# EAGLE design USBtoATAPI (EAGLE 9.6.2)
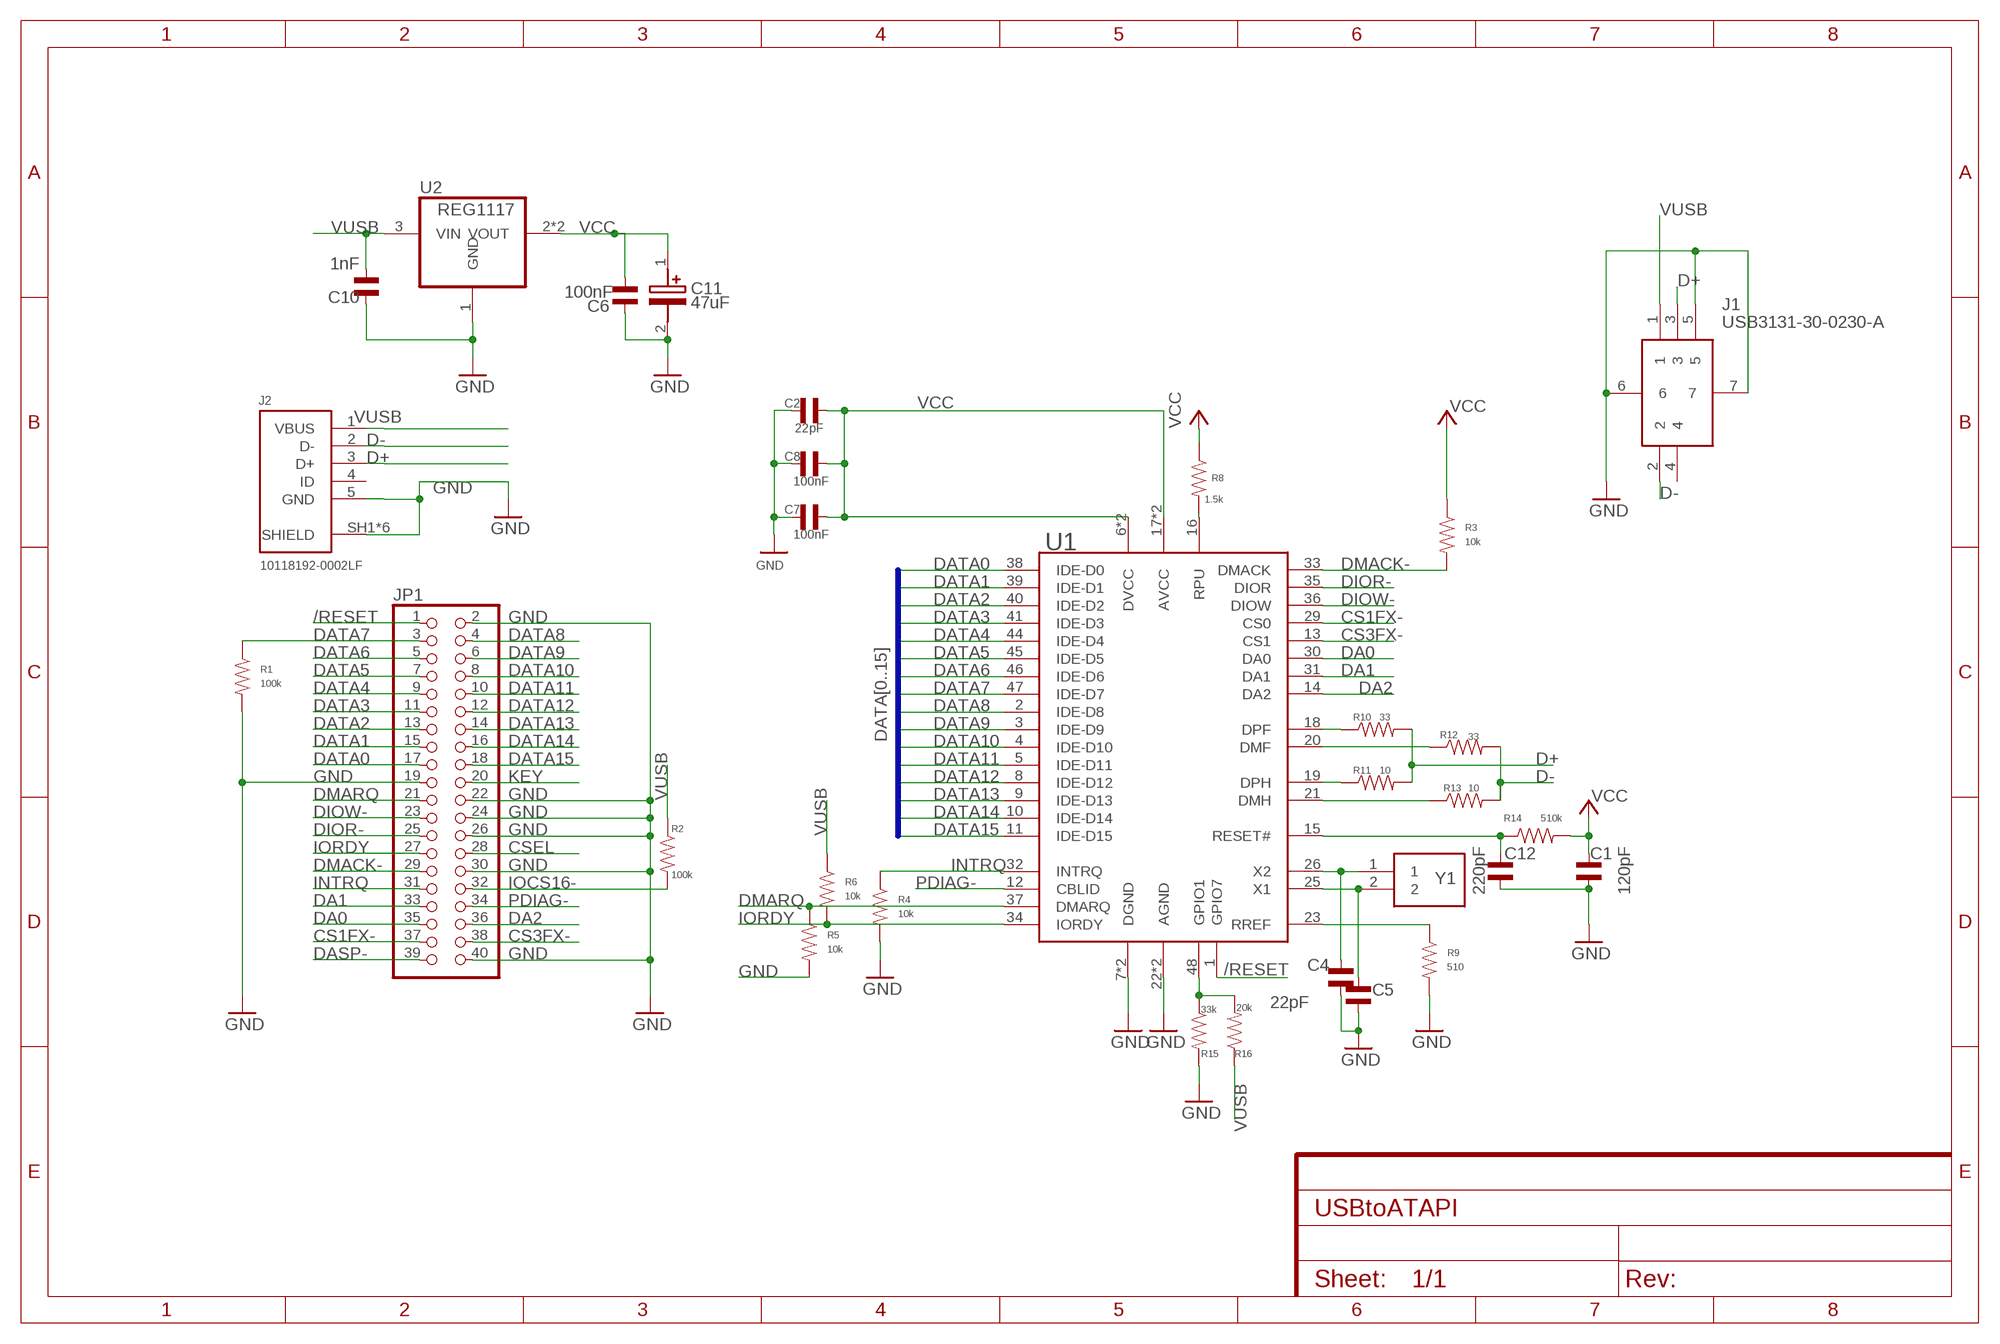
[diagram p0: schematic, sheet 1]

## Parts
C1  120pF  CAPACITOR_NP_0805  [C0805]
C2  22pF  CAPACITOR_NP_0805  [C0805]
C4  22pF  CAPACITOR_NP_0805  [C0805]
C5  22pF  CAPACITOR_NP_0805  [C0805]
C6  100nF  CAPACITOR_NP_0805  [C0805]
C7  100nF  CAPACITOR_NP_0805  [C0805]
C8  100nF  CAPACITOR_NP_0805  [C0805]
C10  1nF  CAPACITOR_NP_0805  [C0805]
C11  47uF  UWR0J470MCL1GB  [CAPAE430X550N]
C12  220pF  CAPACITOR_NP_0805  [C0805]
J1  USB3131-30-0230-A  [USB3131300230A]
J2  10118192-0002LF  [10118192-0002LF]
JP1  PINHD-2X20  [2X20]
R1  100k  RESISTOR_0805  [R0805]
R2  100k  RESISTOR_0805  [R0805]
R3  10k  RESISTOR_0805  [R0805]
R4  10k  RESISTOR_0805  [R0805]
R5  10k  RESISTOR_0805  [R0805]
R6  10k  RESISTOR_0805  [R0805]
R8  1.5k  RESISTOR_0805  [R0805]
R9  510  RESISTOR_0805  [R0805]
R10  33  RESISTOR_0805  [R0805]
R11  10  RESISTOR_0805  [R0805]
R12  33  RESISTOR_0805  [R0805]
R13  10  RESISTOR_0805  [R0805]
R14  510k  RESISTOR_0805  [R0805]
R15  33k  RESISTOR_0805  [R0805]
R16  20k  RESISTOR_0805  [R0805]
U1  GL811E  [LQFP-48]
U2  REG1117  [SOT223]
Y1  445C33C12M00000  [445C33C12M00000]

## Nets
/RESET: JP1.1 U1.1(GPIO7)
CS1FX-: JP1.37 U1.29(CS0)
CS3FX-: JP1.38 U1.13(CS1)
CSEL: JP1.28
D+: J1.3 J2.3(D+) R10.P$2 R11.P$2
D-: J1.2 J2.2(D-) R12.P$2 R13.P$2
DA0: JP1.35 U1.30(DA0)
DA1: JP1.33 U1.31(DA1)
DA2: JP1.36 U1.14(DA2)
DASP-: JP1.39
DATA0: JP1.17 U1.38(IDE-D0)
DATA1: JP1.15 U1.39(IDE-D1)
DATA2: JP1.13 U1.40(IDE-D2)
DATA3: JP1.11 U1.41(IDE-D3)
DATA4: JP1.9 U1.44(IDE-D4)
DATA5: JP1.7 U1.45(IDE-D5)
DATA6: JP1.5 U1.46(IDE-D6)
DATA7: JP1.3 R1.P$1 U1.47(IDE-D7)
DATA8: JP1.4 U1.2(IDE-D8)
DATA9: JP1.6 U1.3(IDE-D9)
DATA10: JP1.8 U1.4(IDE-D10)
DATA11: JP1.10 U1.5(IDE-D11)
DATA12: JP1.12 U1.8(IDE-D12)
DATA13: JP1.14 U1.9(IDE-D13)
DATA14: JP1.16 U1.10(IDE-D14)
DATA15: JP1.18 U1.11(IDE-D15)
DIOR-: JP1.25 U1.35(DIOR)
DIOW-: JP1.23 U1.36(DIOW)
DMACK-: JP1.29 R3.P$2 U1.33(DMACK)
DMARQ: JP1.21 R5.P$1 U1.37(DMARQ)
GND: C1.P$1 C2.P$1 C4.P$2 C5.P$1 C6.P$1 C7.P$2 C8.P$2 C10.P$1 C11.2(-) C12.P$1 J1.5 J1.6 J1.7 J2.5(GND) J2.SH1(SHIELD) J2.SH2(SHIELD) J2.SH3(SHIELD) J2.SH4(SHIELD) J2.SH5(SHIELD) J2.SH6(SHIELD) JP1.2 JP1.19 JP1.22 JP1.24 JP1.26 JP1.30 JP1.40 R1.P$2 R4.P$2 R5.P$2 R9.P$2 R15.P$2 U1.7(DGND) U1.22(AGND) U1.27(AGND) U1.42(DGND) U2.1(GND)
INTRQ: JP1.31 R4.P$1 U1.32(INTRQ)
IOCS16-: JP1.32 R2.P$2
IORDY: JP1.27 R6.P$2 U1.34(IORDY)
KEY: JP1.20
N$1: C4.P$1 U1.26(X2) Y1.1
N$2: C5.P$2 U1.25(X1) Y1.2
N$3: R10.P$1 U1.18(DPF)
N$4: R11.P$1 U1.19(DPH)
N$5: R13.P$1 U1.21(DMH)
N$6: R12.P$1 U1.20(DMF)
N$7: R8.P$2 U1.16(RPU)
N$8: C12.P$2 R14.P$1 U1.15(RESET#)
N$9: R15.P$1 R16.P$2 U1.48(GPIO1)
N$10: R9.P$1 U1.23(RREF)
PDIAG-: JP1.34 U1.12(CBLID)
VCC: C1.P$2 C2.P$2 C6.P$2 C7.P$1 C8.P$1 C11.1(+) R3.P$1 R8.P$1 R14.P$2 U1.6(DVCC) U1.17(AVCC) U1.24(AVCC) U1.43(DVCC) U2.2(VOUT) U2.4(VOUT)
VUSB: C10.P$2 J1.1 J2.1(VBUS) R2.P$1 R6.P$1 R16.P$1 U2.3(VIN)
Unconnected: J1.4 J2.4(ID)

## Buses
DATA[0..15]

## Library data of the parts
C1 C2 C4-C8 C10 C12 = MF_Passives:CAPACITOR_NP: Library: MF_Passives Description: Device for Non-Polarized Capacitors. Manufacture part number (MPN) can be added via Attributes. Check https://factory.macrofab.com/parts for the house parts list.; POPULATE: 1
C11 = SamacSys_Parts:UWR0J470MCL1GB: Aluminum Electrolytic Capacitors - SMD Source: Datasheet <https://componentsearchengine.com/Datasheets/1/UWR0J470MCL1GB.pdf>; DESCRIPTION: Aluminum Electrolytic Capacitors - SMD; HEIGHT: 5.5mm; MANUFACTURER_NAME: Nichicon; MANUFACTURER_PART_NUMBER: UWR0J470MCL1GB; MOUSER_PART_NUMBER: 647-UWR0J470MCL1GB; MOUSER_PRICE-STOCK: https://www.mouser.com/Search/Refine.aspx?Keyword=647-UWR0J470MCL1GB
J1 = SamacSys_Parts:USB3131-30-0230-A: GCT (GLOBAL CONNECTOR TECHNOLOGY) - USB3131-30-0230-A - MICRO USB, 2.0 TYPE B, RECEPTACLE, THT Source: Datasheet <https://gct.co/files/drawings/usb3131.pdf>; DESCRIPTION: GCT (GLOBAL CONNECTOR TECHNOLOGY) - USB3131-30-0230-A - MICRO USB, 2.0 TYPE B, RECEPTACLE, THT; HEIGHT: 5.6mm; MANUFACTURER_NAME: GCT (GLOBAL CONNECTOR TECHNOLOGY); MANUFACTURER_PART_NUMBER: USB3131-30-0230-A; MOUSER_PART_NUMBER: 640-USB3131300230A; MOUSER_PRICE-STOCK: https://www.mouser.co.uk/ProductDetail/GCT/USB3131-30-0230-A?qs=KUoIvG%2F9IlYmRfH6E2AKbw%3D%3D
J2 = USB connector:10118192-0002LF: CONN RCPT USB2.0 MICRO B SMD R/A Manufacturer's datasheet <https://www.amphenol-icc.com/media/wysiwyg/files/drawing/10118192.pdf>; CREATED_BY: PCBLayout.com; DIGIKEY_PARTNO: 609-5379-2-ND; MANUFACTURER: Amphenol ICC (FCI); MPN: 10118192-0002LF
JP1 = adafruit:PINHD-2X20: PIN HEADER
R1-R6 R8-R16 = MF_Passives:RESISTOR: Library: MF_Passives Description: Device for Resistors. Manufacture part number (MPN), Voltage, Tolerance, and Wattage Rating can be added via Attributes. Check https://factory.macrofab.com/parts for the house parts list.; POPULATE: 1
U1 = GenesisLogic:GL811E
U2 = burr-brown:REG1117: 800mA and 1A Low Dropout (LDO) Positive Regulator 1.8V, 2.5V, 2.85V, 3.3V, 5V, and Adj; MPN: REG1117; OC_FARNELL: 1097566; OC_NEWARK: 14P6981
Y1 = SamacSys_Parts:445C33C12M00000: Crystals 12MHz +/-30ppm 16pF -20C +70C Source: Datasheet <https://componentsearchengine.com/Datasheets/1/445C33C12M00000.pdf>; DESCRIPTION: Crystals 12MHz +/-30ppm 16pF -20C +70C; HEIGHT: 1.35mm; MANUFACTURER_NAME: CTS; MANUFACTURER_PART_NUMBER: 445C33C12M00000; MOUSER_PART_NUMBER: 774-445C33C12M00000; MOUSER_PRICE-STOCK: https://www.mouser.com/Search/Refine.aspx?Keyword=774-445C33C12M00000

## Board
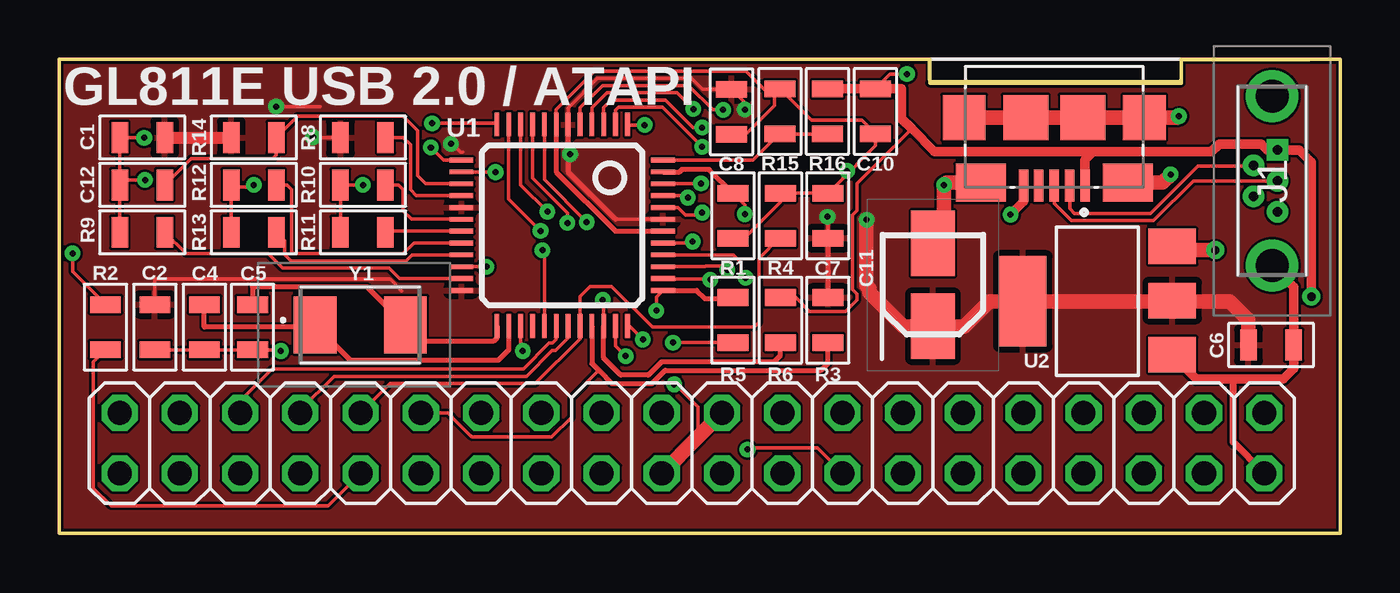
[diagram p1: board, top side]
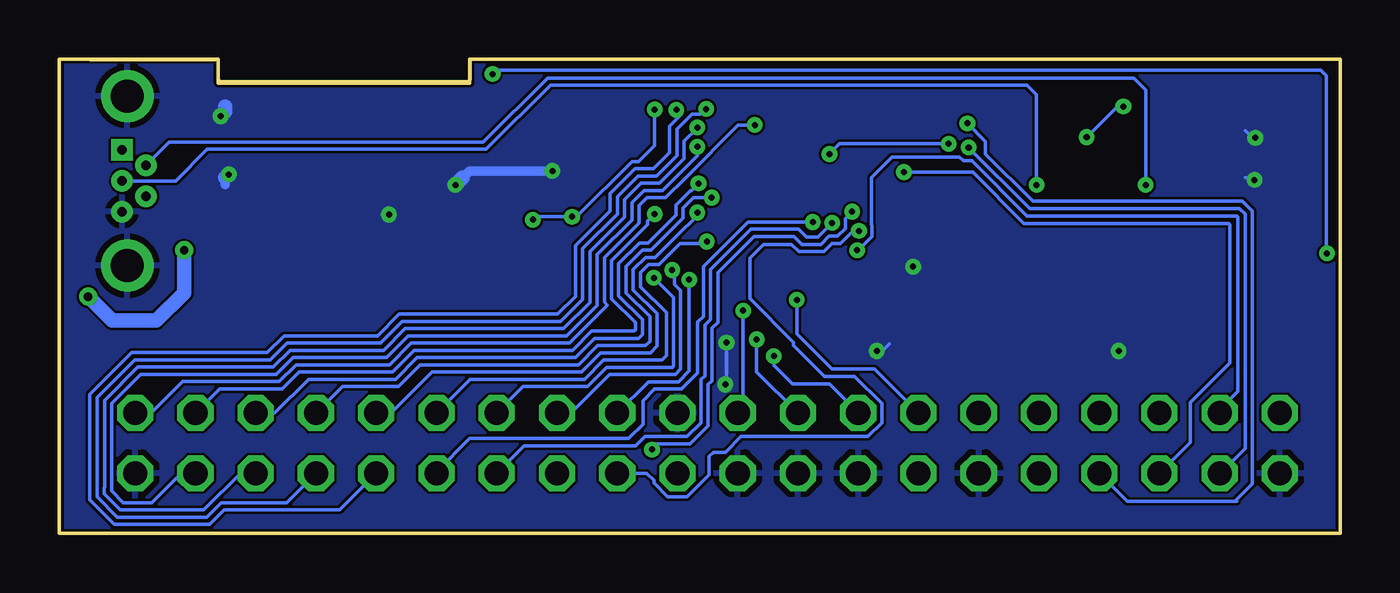
[diagram p2: board, bottom side, seen from below]

Size 54 x 20 mm. Coordinates in mm from the lower left corner, seen from the top.
Outline: 0,0 0,20 36.7,20 36.7,19 47.3,19 47.3,20 54,20 54,0 0,0
Copper layers (1*16): Top 0.035mm / dielectric 1.5mm / Bottom 0.035mm
Design rules "default *": minimum track width 6mil, minimum drill 10mil, track to track 4mil, track to pad 4mil, pad to pad 4mil, via to via 4mil, smd to smd 6mil, copper to edge 6mil, drill to drill 6mil, minimum pad ring 10mil, minimum via ring 8mil, stop-mask expansion 4mil, vias tented up to drill 10mil, thermal gap 10mil
Milling: 19 lines

### Footprints (pad centres in the part's own frame; a part is rotated, then mirrored left to right if it is on the bottom)
C0805 = smd 0.7 x 1.3: P$1 -0.95,0; P$2 0.95,0
CAPAE430X550N = smd 2.75 x 1.85: 1 -1.75,0; 2 1.75,0
USB3131300230A = drill 0.4 pad 0.8 square: 1 0,0 | drill 0.4 pad 0.8: 2 0.65,-1; 3 1.3,0; 4 1.95,-1; 5 2.6,0 | drill 1.395 pad 2.2: 6 -2.275,-0.22; 7 4.875,-0.22
10118192-0002LF = smd 0.4 x 1.35: 1 -1.3,2.875; 2 -0.65,2.875; 3 0,2.875; 4 0.65,2.875; 5 1.3,2.875 | smd 2.1 x 1.6: SH1 -3.1,2.75; SH2 3.1,2.75 | smd 1.8 x 1.9: SH3 -3.8,0; SH4 3.8,0 | smd 1.9 x 1.9: SH5 -1.2,0; SH6 1.2,0
2X20 = drill 1.016 octagon: 1 -24.13,-1.27; 2 -24.13,1.27; 3 -21.59,-1.27; 4 -21.59,1.27; 5 -19.05,-1.27; 6 -19.05,1.27; 7 -16.51,-1.27; 8 -16.51,1.27; 9 -13.97,-1.27; 10 -13.97,1.27; 11 -11.43,-1.27; 12 -11.43,1.27; 13 -8.89,-1.27; 14 -8.89,1.27; 15 -6.35,-1.27; 16 -6.35,1.27; 17 -3.81,-1.27; 18 -3.81,1.27; 19 -1.27,-1.27; 20 -1.27,1.27; 21 1.27,-1.27; 22 1.27,1.27; 23 3.81,-1.27; 24 3.81,1.27; 25 6.35,-1.27; 26 6.35,1.27; 27 8.89,-1.27; 28 8.89,1.27; 29 11.43,-1.27; 30 11.43,1.27; 31 13.97,-1.27; 32 13.97,1.27; 33 16.51,-1.27; 34 16.51,1.27; 35 19.05,-1.27; 36 19.05,1.27; 37 21.59,-1.27; 38 21.59,1.27; 39 24.13,-1.27; 40 24.13,1.27
R0805 = smd 0.7 x 1.3: P$1 -0.95,0; P$2 0.95,0
LQFP-48 = smd 0.2 x 1: 1 -2.75,-4.25; 2 -2.25,-4.25; 3 -1.75,-4.25; 4 -1.25,-4.25; 5 -0.75,-4.25; 6 -0.25,-4.25; 7 0.25,-4.25; 8 0.75,-4.25; 9 1.25,-4.25; 10 1.75,-4.25; 11 2.25,-4.25; 12 2.75,-4.25; 25 2.75,4.25; 26 2.25,4.25; 27 1.75,4.25; 28 1.25,4.25; 29 0.75,4.25; 30 0.25,4.25; 31 -0.25,4.25; 32 -0.75,4.25; 33 -1.25,4.25; 34 -1.75,4.25; 35 -2.25,4.25; 36 -2.75,4.25 | smd 1 x 0.2: 13 4.25,-2.75; 14 4.25,-2.25; 15 4.25,-1.75; 16 4.25,-1.25; 17 4.25,-0.75; 18 4.25,-0.25; 19 4.25,0.25; 20 4.25,0.75; 21 4.25,1.25; 22 4.25,1.75; 23 4.25,2.25; 24 4.25,2.75; 37 -4.25,2.75; 38 -4.25,2.25; 39 -4.25,1.75; 40 -4.25,1.25; 41 -4.25,0.75; 42 -4.25,0.25; 43 -4.25,-0.25; 44 -4.25,-0.75; 45 -4.25,-1.25; 46 -4.25,-1.75; 47 -4.25,-2.25; 48 -4.25,-2.75
SOT223 = smd 1.499 x 2.007: 1 -2.261,-3.15; 2 0.025,-3.15; 3 2.311,-3.15 | smd 3.81 x 2.007: 4 0,3.15
445C33C12M00000 = smd 1.8 x 2.4: 1 -1.9,0; 2 1.9,0

### Placement (x,y rotation side)
C1  3.5,16.7 0 top
C2  4.03,8.7 90 top
C4  6.12,8.7 270 top
C5  8.15,8.7 90 top
C6  51.09,7.95 180 top
C7  32.4,13.4 90 top
C8  28.34,17.79 270 top
C10  34.41,17.8 90 top
C11  36.83,10.49 90 top
C12  3.5,14.7 0 top
J1  51.35,16.17 270 top
J2  41.95,17.54 180 top
JP1  26.67,3.81 180 top
R1  28.4,13.4 270 top
R2  1.95,8.7 270 top
R3  32.4,9 270 top
R4  30.4,13.4 90 top
R5  28.4,9 270 top
R6  30.4,9 270 top
R8  12.8,16.7 0 top
R9  3.5,12.7 180 top
R10  12.8,14.7 180 top
R11  12.8,12.7 180 top
R12  8.2,14.7 180 top
R13  8.2,12.7 180 top
R14  8.2,16.7 180 top
R15  30.38,17.8 90 top
R16  32.38,17.8 270 top
U1  21.2,13 180 top
U2  43.77,9.79 90 top
Y1  12.68,8.8 0 top

### Tracks (layer width: path | path; a pad name or v marks a point on that pad's centre or on a via)
/RESET  (via drill 0.25)
  Top 0.152: v24.68,17.23 23.98,17.23 U1.1
  Bottom 0.152: JP1.1 50.12,5.08 48.8,6.41 44.73,6.41 44.02,7.11 40.08,7.11 39.16,8.03 32.49,8.03 30.9,9.62 30.9,9.64 31.02,9.77 31.02,11.64 29.56,13.1 29.56,13.83 29.23,14.16 28.44,14.16 27.61,14.99 27.61,15 25.38,17.23 v24.68,17.23
CS1FX-  (via drill 0.25)
  Top 0.152: v20.37,11.95 20.45,11.87 U1.29
  Bottom 0.152: JP1.37 5.08,5.23 4.32,6 4.32,13.34 4.37,13.39 13.2,13.39 15.54,15.72 15.89,15.72 16.05,15.88 18.89,15.88 19.76,15.01 19.76,13.02 19.73,12.99 19.73,12.53 20.31,11.95 v20.37,11.95
CS3FX-  (via drill 0.25)
  Top 0.152: U1.13 16.2,15.75 v15.66,16.28
  Bottom 0.152: v15.66,16.28 13.09,13.71 4.26,13.71 4.01,13.46 4.01,3.58 5.05,2.54 JP1.38
D+  (via drill 0.25)
  Top 0.152: R11.P$2 R10.P$2 v12.8,14.7 | J2.3 41.95,13.92 42.67,13.2 46.13,13.2 47.8,14.87 J1.3
  Bottom 0.152: v12.8,14.7 12.8,18.5 13.2,18.9 33.3,18.9 36,16.2 47.77,16.2 49.09,14.87 J1.3
D-  (via drill 0.25)
  Top 0.152: R12.P$2 7.25,14.6 | 7.25,14.6 R13.P$2 | J2.2 42.6,13.7 42.8,13.5 44,13.5 46,13.5 48,15.5 50.33,15.5 J1.2 | v8.2,14.7 8.1,14.6 7.25,14.6
  Bottom 0.152: v8.2,14.7 8.2,18.7 8.71,19.2 33.43,19.2 36.13,16.5 49.37,16.5 J1.2
DA0
  Top 0.152: JP1.35 7.62,5.59 8.96,6.93 19,6.93 19.56,6.93 20.66,8.03 20.8,8.03 20.95,8.18 U1.30
DA1
  Top 0.152: JP1.33 10.16,5.21 11.58,6.63 19,6.63 | 19.19,6.63 19,6.63 | 19,6.63 19.19,6.63 | 19.19,6.63 19.69,6.63 20.78,7.72 20.93,7.72 21.45,8.25 U1.31
DA2  (via drill 0.25)
  Top 0.152: v18.39,15.24 U1.14
  Bottom 0.152: JP1.36 6.32,3.84 6.32,5.52 4.65,7.19 4.65,13.04 4.7,13.08 13.32,13.08 15.48,15.24 v18.39,15.24
DATA0  (via drill 0.25)
  Top 0.152: U1.38 25.48,10.72 27.45,10.72 v27.45,10.7
  Bottom 0.152: v27.45,10.7 27.45,6.85 27.9,6.4 29.16,6.4 JP1.17
DATA1  (via drill 0.25)
  Top 0.152: U1.39 27.23,11.25 27.27,11.29 28.01,11.29 28.16,11.14 v28.16,11.11
  Bottom 0.152: JP1.15 32.42,5.08 30.8,6.71 28.03,6.71 27.8,6.93 27.8,10.24 28.06,10.5 28.06,11.01 v28.16,11.11
DATA2  (via drill 0.25)
  Top 0.152: v28.93,10.78 28.75,10.97 28.75,11.42 28.42,11.75 U1.40
  Bottom 0.152: v28.93,10.78 28.11,9.96 28.11,7.06 28.15,7.01 30.92,7.01 31.73,6.2 34.44,6.2 JP1.13
DATA3  (via drill 0.25)
  Top 0.152: v26.7,12.31 26.64,12.25 U1.41
  Bottom 0.152: JP1.11 36.67,6.5 31.86,6.5 31.05,7.31 28.6,7.31 28.41,7.5 28.41,9.31 29.5,10.4 29.5,11.01 29.16,11.34 28.73,11.34 27.84,12.23 26.78,12.23 v26.7,12.31
DATA4  (via drill 0.25)
  Top 0.152: v27.1,13.53 27,13.43 26.4,13.43 26.08,13.75 25.8,13.75 U1.44
  Bottom 0.152: JP1.9 40.02,5.08 38.29,6.81 31.98,6.81 31.17,7.62 29.08,7.62 28.8,7.9 28.8,9.27 29.8,10.27 29.8,11.13 29.29,11.65 28.88,11.65 27.99,12.54 27.98,12.54 27.1,13.41 v27.1,13.53
DATA5  (via drill 0.25)
  Top 0.152: U1.45 26.23,14.25 26.31,14.17 v26.5,14.17
  Bottom 0.152: JP1.7 42.06,6.2 39.7,6.2 38.79,7.11 32.11,7.11 31.3,7.92 29.28,7.92 29.1,8.1 29.1,9.14 30.11,10.15 30.11,11.26 29.42,11.95 29.05,11.95 27.7,13.3 27.7,13.72 27.26,14.17 v26.5,14.17
DATA6  (via drill 0.25)
  Top 0.152: v27.05,14.77 25.47,14.77 U1.46
  Bottom 0.152: JP1.5 44.92,5.08 43.49,6.5 39.83,6.5 38.91,7.42 32.24,7.42 31.43,8.23 29.57,8.23 29.41,8.39 29.41,9.02 30.41,10.02 30.41,11.38 29.54,12.26 29.17,12.26 28.01,13.42 28.01,13.85 27.39,14.47 27.34,14.47 v27.05,14.77
DATA7  (via drill 0.25)
  Top 0.152: R1.P$1 28.9,13.85 28.9,13.65 v28.9,13.47
  Top 0.203: U1.47 26.15,15.25 26.25,15.35 27.4,15.35 R1.P$1
  Bottom 0.152: v28.9,13.47 29.2,13.17 29.2,13.03 30.72,11.51 30.72,9.89 29.71,8.89 29.71,8.59 29.77,8.53 31.55,8.53 32.36,7.72 39.04,7.72 39.95,6.81 43.89,6.81 44.6,6.1 47.24,6.1 JP1.3
DATA8  (via drill 0.25)
  Top 0.152: U1.2 23.45,17.85 23.58,17.98 25.43,17.98 v27.1,16.31
  Bottom 0.152: v27.1,16.31 27.1,15.94 28.57,14.46 29.36,14.46 29.86,13.96 29.86,13.23 31.33,11.76 31.33,9.62 32.62,8.33 39.29,8.33 40.2,7.42 44.14,7.42 44.85,6.71 50.57,6.71 51.79,5.49 51.79,1.81 51.8,1.8 51.3,1.3 50.1,1.3 48.86,2.54 JP1.4
DATA9  (via drill 0.25)
  Top 0.152: v27.1,17.12 26.72,17.12 25.56,18.28 23.28,18.28 22.95,17.95 U1.3
  Bottom 0.152: JP1.6 46.36,2.54 47.91,0.99 51.43,0.99 52.1,1.67 52.1,1.93 52.09,1.94 52.09,5.62 50.7,7.01 44.98,7.01 44.27,7.72 40.33,7.72 39.42,8.64 32.74,8.64 31.63,9.75 31.63,11.89 30.17,13.35 30.17,14.08 29.48,14.77 28.7,14.77 27.66,15.81 27.66,16.54 27.1,17.1 v27.1,17.12
DATA10  (via drill 0.25)
  Top 0.152: U1.4 22.45,17.95 23.09,18.59 26.04,18.59 v26.73,17.9
  Bottom 0.152: v26.73,17.9 26.95,17.68 27.33,17.68 27.96,17.05 27.96,15.94 28.83,15.07 29.61,15.07 30.47,14.21 30.47,13.48 31.94,12.02 31.94,9.87 32.87,8.94 39.54,8.94 40.46,8.03 44.4,8.03 45.1,7.32 50.82,7.32 52.4,5.74 52.4,2.06 52.41,2.05 52.41,1.55 51.55,0.69 47.78,0.69 47.17,1.3 44.42,1.3 JP1.8
DATA11  (via drill 0.25)
  Top 0.152: v27.99,17.87 27.55,17.87 26.53,18.89 22.89,18.89 21.95,17.95 U1.5
  Bottom 0.152: JP1.10 42.19,0.99 47.04,0.99 47.65,0.39 51.68,0.39 52.71,1.42 52.71,5.86 50.95,7.62 45.23,7.62 44.52,8.33 40.58,8.33 39.67,9.25 32.99,9.25 32.24,10 32.24,12.14 30.78,13.61 30.78,14.34 29.74,15.38 28.95,15.38 28.27,16.06 28.27,17.18 27.78,17.66 v27.99,17.87
DATA12  (via drill 0.25)
  Top 0.152: U1.8 20.45,14.92 v22.23,13.13
  Bottom 0.152: v22.23,13.13 24.96,13.13 26.85,11.25 26.85,9.15 27.09,8.91 27.09,6.78 27.77,6.09 28.91,6.09 29.4,5.6 29.4,4.6 30,4 36.7,4 38.1,2.6 JP1.12
DATA13  (via drill 0.25)
  Top 0.152: v21.42,13.1 21.42,13.52 19.95,14.99 U1.9
  Bottom 0.152: JP1.14 34.41,3.69 29.7,3.69 29.3,4.1 28.36,4.1 28.35,4.09 27.53,4.09 26.95,4.67 26.95,6.49 26.79,6.65 26.79,8.78 26.54,9.03 26.54,11.12 24.84,12.83 22.83,12.83 22.5,12.5 22.02,12.5 v21.42,13.1
DATA14  (via drill 0.25)
  Top 0.152: U1.10 19.45,14.7 v20.57,13.57 | v29.02,3.54 29.07,3.6 31.96,3.6 JP1.16
  Bottom 0.152: v20.57,13.57 20.86,13.29 20.86,12.87 21.19,12.54 21.55,12.54 21.9,12.2 22.7,12.2 23.03,12.53 24.71,12.53 26.24,11 26.24,8.9 26.48,8.66 26.48,6.44 26.64,6.28 26.64,4.54 27.4,3.79 29,3.79 29.02,3.77 v29.02,3.54
DATA15  (via drill 0.25)
  Top 0.152: v20.29,12.76 18.95,14.1 U1.11
  Bottom 0.152: JP1.18 29.24,2.54 28.93,2.23 28.93,2.13 28.35,1.55 27.53,1.55 26.6,2.48 26.6,3.25 26.43,3.42 25.92,3.42 25.25,4.09 19.91,4.09 19.33,4.67 19.33,5.49 20.47,6.63 21.74,6.63 23.04,7.93 23.04,8.06 24.89,9.91 24.89,11.61 24.3,12.19 23.12,12.19 22.82,11.89 21.77,11.89 21.42,12.24 21.07,12.24 20.54,12.76 v20.29,12.76
DIOR-  (via drill 0.25)
  Top 0.152: U1.35 23.45,7.91 v23.88,7.48
  Bottom 0.152: v23.88,7.48 23.88,7.08 23.1,6.3 21.54,6.3 JP1.25
DIOW-  (via drill 0.25)
  Top 0.152: U1.36 24.03,8.75 v24.6,8.18
  Bottom 0.152: v24.6,8.18 24.6,6.82 JP1.23
DMACK-
  Top 0.152: JP1.29 16.38,5.08 16.79,4.67 17.37,4.09 17.4,4.06 20.75,4.06 21.59,4.9 21.59,5.71 22.72,6.84 22.77,6.84
  Top 0.203: U1.33 22.45,7.16 22.77,6.84 23.29,6.33 24.98,6.33 25.54,6.88 32.12,6.88 32.4,7.16 R3.P$2
DMARQ  (via drill 0.25)
  Top 0.152: v25.17,9.4 25.17,9.97 U1.37
  Top 0.203: U1.37 26.87,10.25 27.22,9.9 28.35,9.9 R5.P$1
  Bottom 0.152: v25.17,9.4 25.17,5.31 JP1.21
GND  (via drill 0.25)
  Top 0.152: R9.P$2 C1.P$1 3.57,16.7 v3.58,16.69 | U1.22 v18,11.25 v18.01,11.25 | C2.P$1 C4.P$2 C5.P$1 9.28,7.75 v9.34,7.7 | C12.P$1 2.76,14.91 v3.62,14.91 | U1.27 19.45,7.78 v19.53,7.7 | R5.P$2 v25.87,8.05 | 26.93,4.07 26.93,5.33 25.97,6.29 v25.92,6.29 | v33.21,15.29 33.21,15.16 32.8,14.74 | 32.8,14.74 C7.P$2 R4.P$2 30.4,13.97 28.88,12.45 R1.P$2 | U1.7 20.95,17.88 22.57,19.5 22.75,19.5 22.76,19.51 28.94,19.51 29.91,18.55 29.91,18.77 30.16,18.77 30.16,18.72 | 30.16,18.72 30.16,18.04 28.95,16.84 C8.P$2 | 30.16,18.72 30.35,18.72 R15.P$2 31.7,17.43 33.83,17.43 C10.P$1 34.41,16.36 32.8,14.74
  Top 0.203: U1.7 20.95,15.25 23.45,12.75 U1.42
  Top 0.254: J2.SH2 38.15,15.49
  Top 0.305: JP1.2 49.49,3.85 49.49,6.52
  Top 0.406: J2.5 40.65,13.99 v40.1,13.45 | v37.3,14.7 37.3,14.18 | U2.1 47.93,6.52 49.49,6.52 51.6,6.52 52.04,6.95 C6.P$1 52.04,10.39 J1.7
  Top 0.61: J2.SH4 J2.SH6 J2.SH5 J2.SH3 47.14,17.54 v47.2,17.6 | J2.SH2 37.39,14.79 v37.3,14.7 37.3,12.71 C11.2 | J2.SH1 46.5,14.79 v46.85,15.14 | JP1.19 26.93,4.07 JP1.22
  Bottom 0.152: v40.1,13.45 40.1,13.37 40.05,13.32 | v18.01,11.25 18.01,11.01 18,11 | v3.58,16.69 3.69,16.69 4,17 | v9.34,7.7 9.34,7.67 | v3.62,14.91 3.71,15 4,15 | v19.53,7.7 19.3,7.7 19,8 | v25.87,8.05 25.87,6.39 25.92,6.34 v25.92,6.29
  Bottom 0.406: 37,15 36.71,15.29 v33.21,15.29 | 47,14.72 47,15
  Bottom 0.61: v47.2,17.6 47,17.8 47,18 | v37.3,14.7 37,15 | 47,15 v46.85,15.14
  pour Bottom: 0,20 54,20 54,0 0,0
INTRQ
  Top 0.152: R4.P$1 30.35,12.45 29.5,11.6 29.5,8.9 29.3,8.7 25,8.7 23.29,10.41 22.38,10.41 21.95,9.98 U1.32 21.95,8.21 20.06,6.33 13.95,6.33 JP1.31
IOCS16-
  Top 0.152: R2.P$2 1.44,7.24 1.44,1.91 2.18,1.17 11.33,1.17 JP1.32
IORDY  (via drill 0.25)
  Top 0.152: U1.34 22.95,9.81 v22.91,9.85
  Top 0.203: R6.P$2 30.4,7.52 30.12,7.24 25.39,7.24 24.84,6.68 23.67,6.68 22.95,7.4 U1.34
  Bottom 0.152: v22.91,9.85 22.91,8.41 21.43,6.93 19.63,6.93 JP1.27
N$1
  Top 0.203: U1.26 18.95,7.75 18.5,7.3 12.29,7.3 Y1.1 10.69,8.7 6.12,8.7 C4.P$1
N$2
  Top 0.203: U1.25 18.45,8.25 18.3,8.1 14.59,8.1 Y1.2 12.98,10.4 8.15,10.4 C5.P$2
N$3
  Top 0.152: U1.18 14.85,13.25 14.5,13.61 14.5,14.5 14.3,14.7 R10.P$1
N$4
  Top 0.152: U1.19 13.8,12.75 R11.P$1
N$5
  Top 0.152: R13.P$1 9.49,12.36 9.49,11.77 9.77,11.49 14.63,11.49 14.88,11.75 U1.21
N$6
  Top 0.152: U1.20 14.95,12.25 14.5,11.8 9.9,11.8 9.8,11.9 9.8,14.5 9.6,14.7 R12.P$1
N$7
  Top 0.152: U1.16 15.05,14.25 14.8,14.5 14.8,16.4 14.5,16.7 R8.P$2
N$8
  Top 0.152: U1.15 15.45,14.75 15.11,15.1 15.11,17 14.5,17.6 10.05,17.6 R14.P$1 9.15,15.95 9,15.8 5.55,15.8 C12.P$2
N$9
  Top 0.152: U1.48 29.24,15.75 30.34,16.85 R15.P$1 R16.P$2
N$10
  Top 0.152: U1.23 14.35,10.75 13.91,11.19 9.41,11.19 8.8,11.8 5.35,11.8 R9.P$1
PDIAG-  (via drill 0.25)
  Top 0.152: v15.72,17.3 18.4,17.3 U1.12
  Bottom 0.152: JP1.34 8.97,1.35 4.45,1.35 | 4.45,1.35 4.37,1.35 | 4.45,1.35 3.71,2.1 3.71,13.59 4.13,14.01 12.96,14.01 14.96,16.01 14.96,16.54 v15.72,17.3
VCC  (via drill 0.25)
  Top 0.152: 14.44,10.23 13.94,10.73 4.03,10.73 C2.P$2 | R8.P$1 10.7,16.7 v10.69,16.71 | v9.14,18.01 10.99,18.01 11,18 | 21.45,17 21.45,16.09 v21.53,16 | v16.51,16.43 16.57,16.43 16.92,16.08 17,16.08 | U1.43 23.45,13.25 | C7.P$1 32.4,13.34 v32.38,13.36 | v34.03,13.23 34.03,13.01 34.08,12.95 | U1.6 21.45,17.95 22.7,19.2 26.65,19.2 27.12,18.73 C8.P$1 28.9,18.17 v28.9,17.88
  Top 0.203: C7.P$1 R3.P$1 | U1.6 21.45,17 21.45,15.25 23.45,13.25
  Top 0.508: C1.P$2 R14.P$2
  Top 0.61: U2.4 40.85,9.79 | 40.85,9.79 46.89,9.79 | 46.89,9.79 U2.2 | C6.P$2 50.14,9 49.35,9.79 46.89,9.79 | 40.85,9.79 39.22,9.79 38.16,8.74 C11.1 35.59,8.74 34.16,10.16 34.16,10.32 34.03,10.45 v34.03,13.23
  Top 0.813: 40.65,9.82 U2.4 40.62,9.94
  Bottom 0.152: v10.69,16.71 9.27,18.14 v9.14,18.01 | v21.53,16 21.1,16.43 v16.51,16.43 | v34.03,13.23 33.91,13.36 32.43,13.36 | 32.43,13.36 v32.38,13.36 | v28.9,17.88 28.9,16.36 29.58,15.68 29.86,15.68 32.19,13.36 32.43,13.36
  pour Top: 0,20 54,20 54,0 0,0
VUSB  (via drill 0.25, 0.35)
  Top 0.152: R6.P$1 31.05,9.95 31.63,9.37 33.15,9.37 33.63,9.85 33.63,10.1 33.45,10.28 33.45,13.44 33.63,13.62 33.63,14.76 35.14,16.27 35.15,16.27 35.28,16.41 35.28,16.42 35.94,17.07 | R2.P$1 0.56,11.04 v0.56,11.81 | v35.73,19.38 35.02,19.38 34.39,18.75 C10.P$2
  Top 0.406: J2.1 43.25,15.75 43.6,16.1 44,16.1 | U2.3 47.76,12.1 | 44,16.1 36.9,16.1 35.94,17.07 35.51,17.49 35.51,18.75 C10.P$2 | 33.53,18.75 34.39,18.75 R16.P$1 | 44,16.1 48.57,16.1 48.9,16.42 50.67,16.42 50.93,16.17 J1.1 52.28,16.17 52.79,15.66 v52.79,9.99
  Top 0.61: U2.3 47.08,11.95 v48.74,11.95
  Bottom 0.152: v0.56,11.81 0.58,11.81 0.58,19.3 0.81,19.53 35.73,19.53 v35.73,19.38
  Bottom 0.61: v48.74,11.95 48.74,10.15 49.91,8.97 51.77,8.97 v52.79,9.99

### Text on the board
tPlace: GL811E USB 2.0 / ATAPI